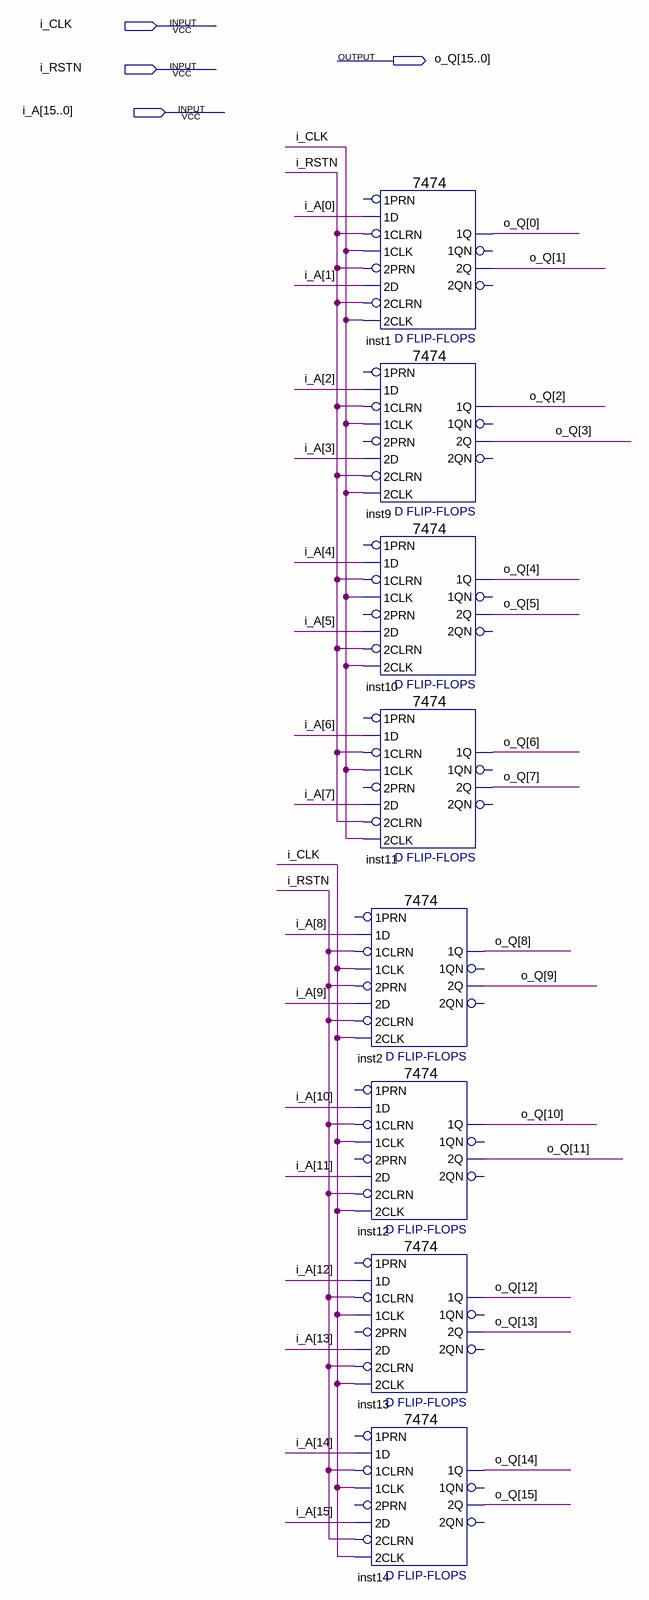
[diagram p0: schematic sheet]
// Quartus schematic dff_15bit.bdf as structural Verilog: 8 symbols, 4 pins
module dff_15bit (
  input  i_CLK,
  input  i_RSTN,
  input  [15:0] i_A,
  output [15:0] o_Q
);

  \7474  inst2 (
    .\2D (i_A[9]), .\2PRN (i_RSTN), .\1CLK (i_CLK), .\1D (i_A[8]), .\2CLK (i_CLK), .\2CLRN (i_RSTN),
    .\1CLRN (i_RSTN), .\2Q (o_Q[9]), .\1Q (o_Q[8]));  // open: 1PRN, 1QN, 2QN
  \7474  inst12 (
    .\2D (i_A[11]), .\1CLK (i_CLK), .\1D (i_A[10]), .\2CLK (i_CLK), .\2CLRN (i_RSTN), .\1CLRN (i_RSTN),
    .\2Q (o_Q[11]), .\1Q (o_Q[10]));  // open: 2PRN, 1PRN, 1QN, 2QN
  \7474  inst13 (
    .\2D (i_A[13]), .\1CLK (i_CLK), .\1D (i_A[12]), .\2CLK (i_CLK), .\2CLRN (i_RSTN), .\1CLRN (i_RSTN),
    .\2Q (o_Q[13]), .\1Q (o_Q[12]));  // open: 2PRN, 1PRN, 1QN, 2QN
  \7474  inst14 (
    .\2D (i_A[15]), .\1CLK (i_CLK), .\1D (i_A[14]), .\2CLK (i_CLK), .\2CLRN (i_RSTN), .\1CLRN (i_RSTN),
    .\2Q (o_Q[15]), .\1Q (o_Q[14]));  // open: 2PRN, 1PRN, 1QN, 2QN
  \7474  inst1 (
    .\2D (i_A[1]), .\2PRN (i_RSTN), .\1CLK (i_CLK), .\1D (i_A[0]), .\2CLK (i_CLK), .\2CLRN (i_RSTN),
    .\1CLRN (i_RSTN), .\2Q (o_Q[1]), .\1Q (o_Q[0]));  // open: 1PRN, 1QN, 2QN
  \7474  inst9 (
    .\2D (i_A[3]), .\1CLK (i_CLK), .\1D (i_A[2]), .\2CLK (i_CLK), .\2CLRN (i_RSTN), .\1CLRN (i_RSTN),
    .\2Q (o_Q[3]), .\1Q (o_Q[2]));  // open: 2PRN, 1PRN, 1QN, 2QN
  \7474  inst10 (
    .\2D (i_A[5]), .\1CLK (i_CLK), .\1D (i_A[4]), .\2CLK (i_CLK), .\2CLRN (i_RSTN), .\1CLRN (i_RSTN),
    .\2Q (o_Q[5]), .\1Q (o_Q[4]));  // open: 2PRN, 1PRN, 1QN, 2QN
  \7474  inst11 (
    .\2D (i_A[7]), .\1CLK (i_CLK), .\1D (i_A[6]), .\2CLK (i_CLK), .\2CLRN (i_RSTN), .\1CLRN (i_RSTN),
    .\2Q (o_Q[7]), .\1Q (o_Q[6]));  // open: 2PRN, 1PRN, 1QN, 2QN
endmodule
